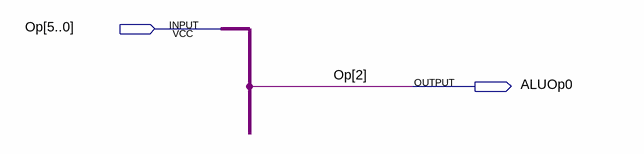
[diagram p0: schematic sheet]
// Quartus schematic ALUOp0Decoder.bdf as structural Verilog: 0 symbols, 2 pins
module ALUOp0Decoder (
  input  [5:0] Op,
  output ALUOp0
);


  assign ALUOp0 = Op[2];
endmodule
